# EasyEDA schematic offzone-addon-s7-easyeda-sheet.json
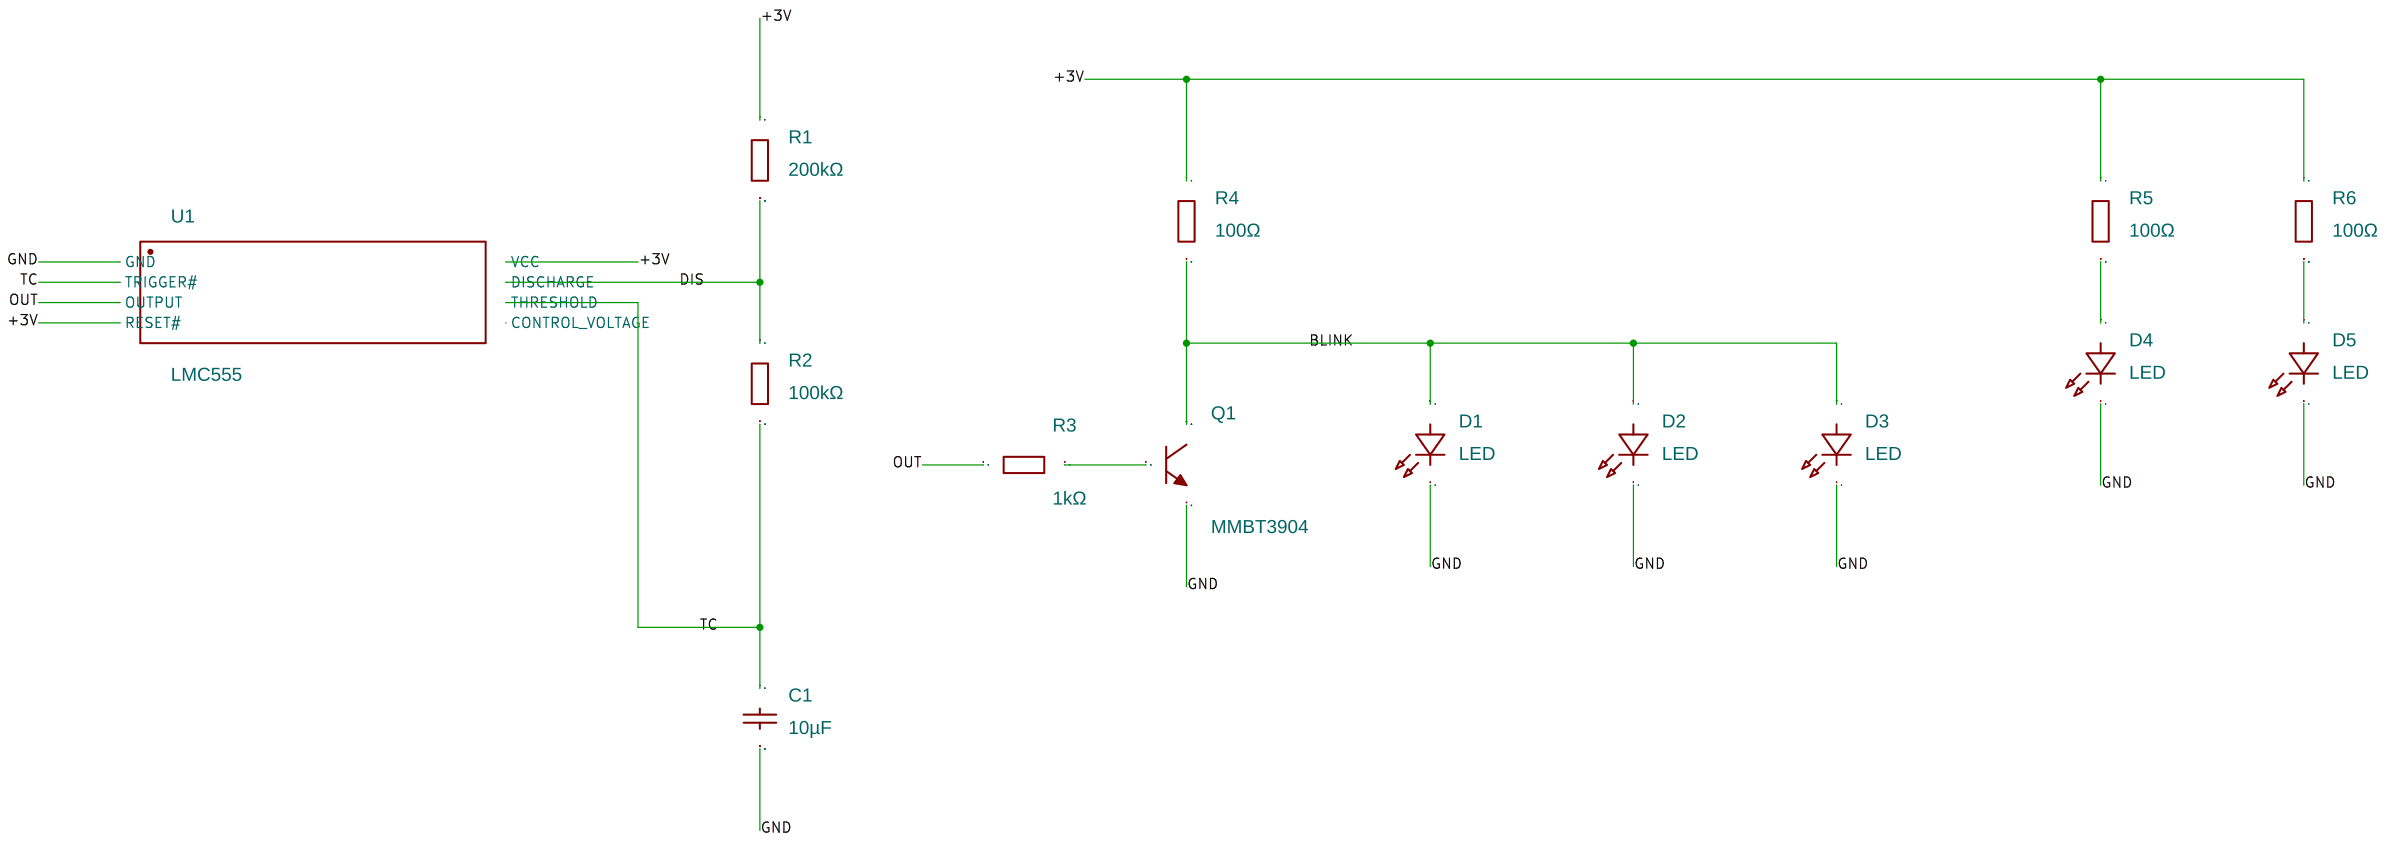
[diagram p0: schematic sheet]

## Parts
C1  10µF  [C0805]
D1  LED  [LED0805-RD_RED]
D2  LED  [LED0805-RD_RED]
D3  LED  [LED0805-RD_RED]
D4  LED  [LED0805-RD_RED]
D5  LED  [LED0805-RD_RED]
Q1  MMBT3904  [SOT-23-3_L2.9-W1.6-P1.90-LS2.8-BR]
R1  200kΩ  [R0603]
R2  100kΩ  [R0603]
R3  1kΩ  [R0603]
R4  100Ω  [R0603]
R5  100Ω  [R0603]
R6  100Ω  [R0603]
U1  LMC555  [SOP-8_L4.9-W3.9-P1.27-LS6.0-BL]

## Library data of the parts
C1 = CL21A106KOQNNNE: Contributor: LCSC; Supplier: LCSC; Supplier Part: C1713; Manufacturer: SAMSUNG(三星); JLCPCB Part Class: Extended Part
D1-D5 = 17-21/R6C-AQ2R2B/4T: Contributor: LCSC; Supplier: LCSC; Supplier Part: C2971979; Manufacturer: EVERLIGHT(亿光); JLCPCB Part Class: Extended Part
Q1 = MMBT3904LT1G: Contributor: LCSC; Supplier: LCSC; Supplier Part: C81464; Manufacturer: onsemi(安森美); JLCPCB Part Class: Extended Part
R1 = 0603WAF2003T5E: Contributor: LCSC; Supplier: LCSC; Supplier Part: C25811; Manufacturer: UNI-ROYAL(厚声); JLCPCB Part Class: Basic Part
R2 = 0603WAF1003T5E: Contributor: LCSC; Supplier: LCSC; Supplier Part: C25803; Manufacturer: UNI-ROYAL(厚声); JLCPCB Part Class: Basic Part
R3 = 0603WAF1001T5E: Contributor: LCSC; Supplier: LCSC; Supplier Part: C21190; Manufacturer: UNI-ROYAL(厚声); JLCPCB Part Class: Basic Part
R4-R6 = RC0603FR-07100RL: Contributor: LCSC; Supplier: LCSC; Supplier Part: C105588; Manufacturer: YAGEO(国巨); JLCPCB Part Class: Extended Part
U1 = LMC555M/TR: Contributor: LCSC; Supplier: LCSC; Supplier Part: C356725; Manufacturer: HGSEMI(华冠); JLCPCB Part Class: Extended Part

## Nets
+3V: R1.1 R4.1 R5.1 R6.1 U1.4(RESET#) U1.8(VCC)
GND: C1.2 D1.1(K) D2.1(K) D3.1(K) D4.1(K) D5.1(K) Q1.2 U1.1(GND)
BLINK: D1.2(A) D2.2(A) D3.2(A) Q1.3 R4.2
DIS: R1.2 R2.1 U1.7(DISCHARGE)
OUT: R3.1 U1.3(OUTPUT)
TC: C1.1 R2.2 U1.2(TRIGGER#) U1.6(THRESHOLD)
Net-(D4-2): D4.2(A) R5.2
Net-(D5-2): D5.2(A) R6.2
Net-(Q1-1): Q1.1 R3.2

Not connected (* = marked no-connect by the designer): U1 5(CONTROL VOLTAGE)

## Notes on the sheet
- Автогенератор: t_high = 0,693*(R1+R2)*C1 = 2,08 c;  t_low = 0,693*R2*C1 = 0,69 c
- Период 2,77 c (f = 0,36 Гц), скважность 75 % — вспышка 0,69 c каждые 2,8 c
- OUT = 0 -> Q1 закрыт -> R4 поднимает BLINK -> D1..D3 горят
- OUT = 1 -> Q1 открыт -> BLINK на GND -> D1..D3 погашены
- D4, D5 висят между +3V и GND через R5/R6 и горят постоянно
- 555 обязательно CMOS (LMC555/TLC555/ICM7555): биполярному NE555 нужно от 4,5 В
- Питание +3V — с хост-бейджа или CR2032; разъём/держатель в схеме не нарисован
